# Altium schematic sheet Jlink-OB-HanYuan.SchDoc: JLink-OB HY
size A4; Author: Hanyuan; Revision: ver1.0
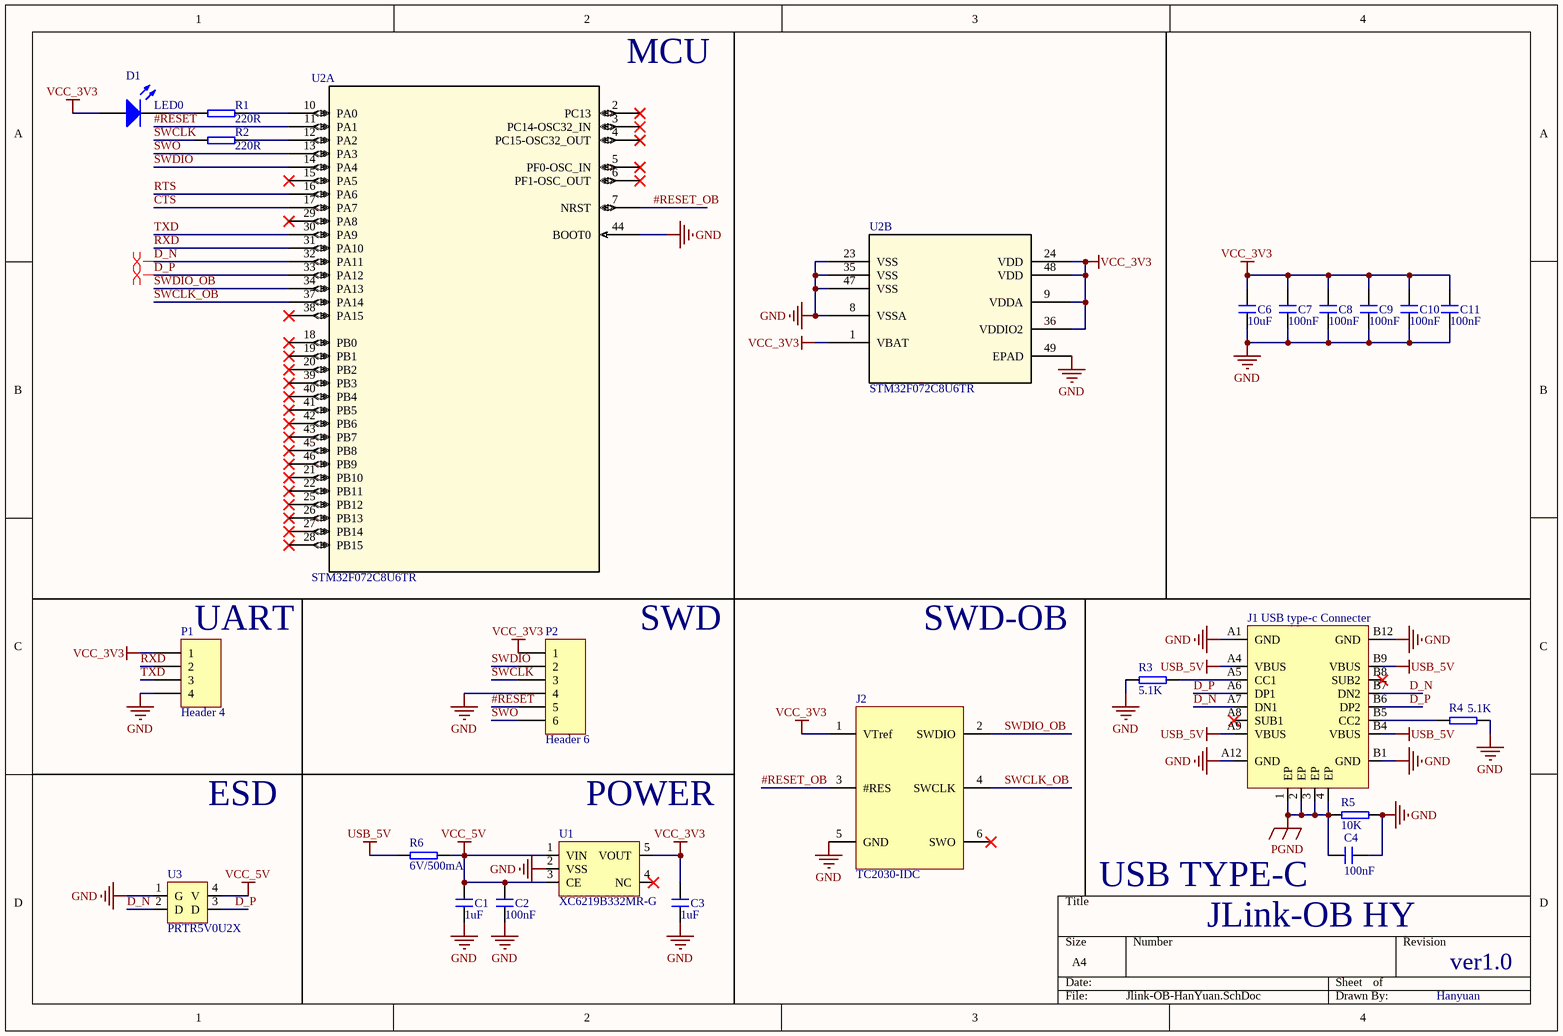
[diagram p0: Jlink-OB-HanYuan.SchDoc]

## Parts
C1  1uF  [C0603]
C2  100nF  [C0402]
C3  1uF  [C0603]
C4  100nF  [C0402]
C6  10uF  [C0603]
C7  100nF  [C0402]
C8  100nF  [C0402]
C9  100nF  [C0402]
C10  100nF  [C0402]
C11  100nF  [C0402]
D1  LED0  [LED0402]
J1  USB type-c Connecter  [USB-C-SMD_KH-TYPE-C-16P]
J2  TC2030-IDC  [JLINK_6PIN_ADAPTOR]
P1  Header 4  [HEADER-4]
P2  Header 6  [header-6]
R1  220R  [R0402]
R2  220R  [R0402]
R3  5.1K  [R0402]
R4  5.1K  [R0402]
R5  10K  [R0402]
R6  6V/500mA  [R0805]
U1  XC6219B332MR-G  [SOT-23-5_L3.0-W1.7-P0.95-LS2.8-BR]
U2  STM32F072C8U6TR  [UFQFPN48-7x7mm]  (parts A,B of 2)
U3  PRTR5V0U2X  [SOT-143_L2.9-W1.3-P1.92-LS2.3-BL]

## Nets
GND: C1.1 C2.1 C3.1 C4.1 C6.1 C7.1 C8.1 C9.1 C10.1 C11.1 J1.A1(GND) J1.A12(GND) J1.B1(GND) J1.B12(GND) J2.5(GND) P1.4 P2.4 R3.0 R4.1 R5.0 U1.2(VSS) U2.8(VSSA) U2.23(VSS) U2.35(VSS) U2.44(BOOT0) U2.47(VSS) U2.49(EPAD) U3.1(G)
PGND: C4.0 J1.1(EP) J1.2(EP) J1.3(EP) J1.4(EP) R5.1
USB_5V: J1.A4(VBUS) J1.A9(VBUS) J1.B4(VBUS) J1.B9(VBUS) R6.0
VCC_3V3: C3.0 C6.0 C7.0 C8.0 C9.0 C10.0 C11.0 D1.1(A) J2.1(VTref) P1.1 P2.1 U1.5(VOUT) U2.1(VBAT) U2.9(VDDA) U2.24(VDD) U2.36(VDDIO2) U2.48(VDD)
VCC_5V: C1.0 C2.0 R6.1 U1.1(VIN) U1.3(CE) U3.4(V)
#RESET: P2.5 U2.11(PA1)
#RESET_OB: J2.3(#RES) U2.7(NRST)
CTS: U2.17(PA7)
D_N: J1.A7(DN1) J1.B7(DN2) U2.32(PA11) U3.2(D)
D_P: J1.A6(DP1) J1.B6(DP2) U2.33(PA12) U3.3(D)
RTS: U2.16(PA6)
RXD: P1.2 U2.31(PA10)
SWCLK: P2.3 R2.0
SWCLK_OB: J2.4(SWCLK) U2.37(PA14)
SWDIO: P2.2 U2.14(PA4)
SWDIO_OB: J2.2(SWDIO) U2.34(PA13)
SWO: P2.6 U2.13(PA3)
TXD: P1.3 U2.30(PA9)
NetD1_2: D1.2(K) R1.0
NetJ1_A5: J1.A5(CC1) R3.1
NetJ1_B5: J1.B5(CC2) R4.0
NetR1_1: R1.1 U2.10(PA0)
NetR2_1: R2.1 U2.12(PA2)

Not connected (* = marked no-connect by the designer): J1 A8(SUB1)* B8(SUB2)*; J2 6(SWO)*; U1 4(NC)*; U2 2(PC13)* 3(PC14-OSC32_IN)* 4(PC15-OSC32_OUT)* 5(PF0-OSC_IN)* 6(PF1-OSC_OUT)* 15(PA5)* 18(PB0)* 19(PB1)* 20(PB2)* 21(PB10)* 22(PB11)* 25(PB12)* 26(PB13)* 27(PB14)* 28(PB15)* 29(PA8)* 38(PA15)* 39(PB3)* 40(PB4)* 41(PB5)* 42(PB6)* 43(PB7)* 45(PB8)* 46(PB9)*

## Layout directives
differential pair; differential pair class usb; rule Differential Pairs Routing [Pref Gap = 5mil    Min Gap  = 5mil    Max Gap  = 5milPref Width = 7.1mil    Min Width  = 7mil    Max Width  = 7.2mil]: D_N
differential pair: D_P

## Notes on the sheet
- (near U2) MCU
- (near P1) UART
- SWD
- SWD-OB
- ESD
- (near U1) POWER
- USB TYPE-C

## Library data of the parts
C1 C3 = Capacitance: Componet: GRM185R61E105KA12D; Value: 1uF
C2 C4 C7-C11 = Capacitance: Componet: GRM155R11C104KA88D; Value: 100nF
C6 = Capacitance: Componet: GRM188R61E106MA73D; Value: 10uF
D1 = LED0: Typical INFRARED GaAs LED; Componet: 16-213/GHC-YR1S1/3T; Published: 8-Jun-2000; LatestRevisionDate: 08-Jul-2005; LatestRevisionNote: Mech Layer 1 removed.; PackageReference: LED-0; Publisher: Altium Limited; PackageDescription: LED; 2 Leads
J1 = USB type-c Connecter: Componet: KH-TYPE-C-16P
J2 = TC2030-IDC: J-Link 6-pin Programming Pads; Componet: TC2030-IDC
P1 = Header 4: Header, 4-Pin; Componet: 2.54mm; LatestRevisionDate: 17-Jul-2002; LatestRevisionNote: Re-released for DXP Platform.; Publisher: Altium Limited
P2 = Header 6: Header, 6-Pin; Componet: 2.54mm; LatestRevisionDate: 17-Jul-2002; LatestRevisionNote: Re-released for DXP Platform.; Publisher: Altium Limited
R1 R2 = Resistance: Componet: AC0402FR-07220RL; Value: 220R
R3 R4 = Resistance: Componet: RC0402JR-075K1L; Value: 5.1K
R5 = Resistance: Componet: AC0402DR-0710KL; Value: 10K
R6 = Resistance: Componet: PICOSMDC050S-2; Value: 6V/500mA
U1 = XC6219B332MR: Componet: XC6219B332MR
U2 = STM32F072C8U6TR: No Description Available; Vendor: STMicroelectronics; Built_By: EMA_Jessica; SourceLibrary: STMicroelectronics_2020-10-07; Manufacturer_Part_Number: STM32F072C8U6TR; Copyright: Copyright (C) 2018 Accelerated Designs. All rights reserved; RefDes: RefDes; Type: DEV
U3 = PRTR5V0U2X: Componet: PRTR5V0U2X